# Altium project STM32G4_DRV8301_hardware.PrjPcb (part 2 of 5)

## Sheet M1_DRV8301_driver.SchDoc
size 594 x 420 mm; SheetNumber: 5; SheetTotal: 9
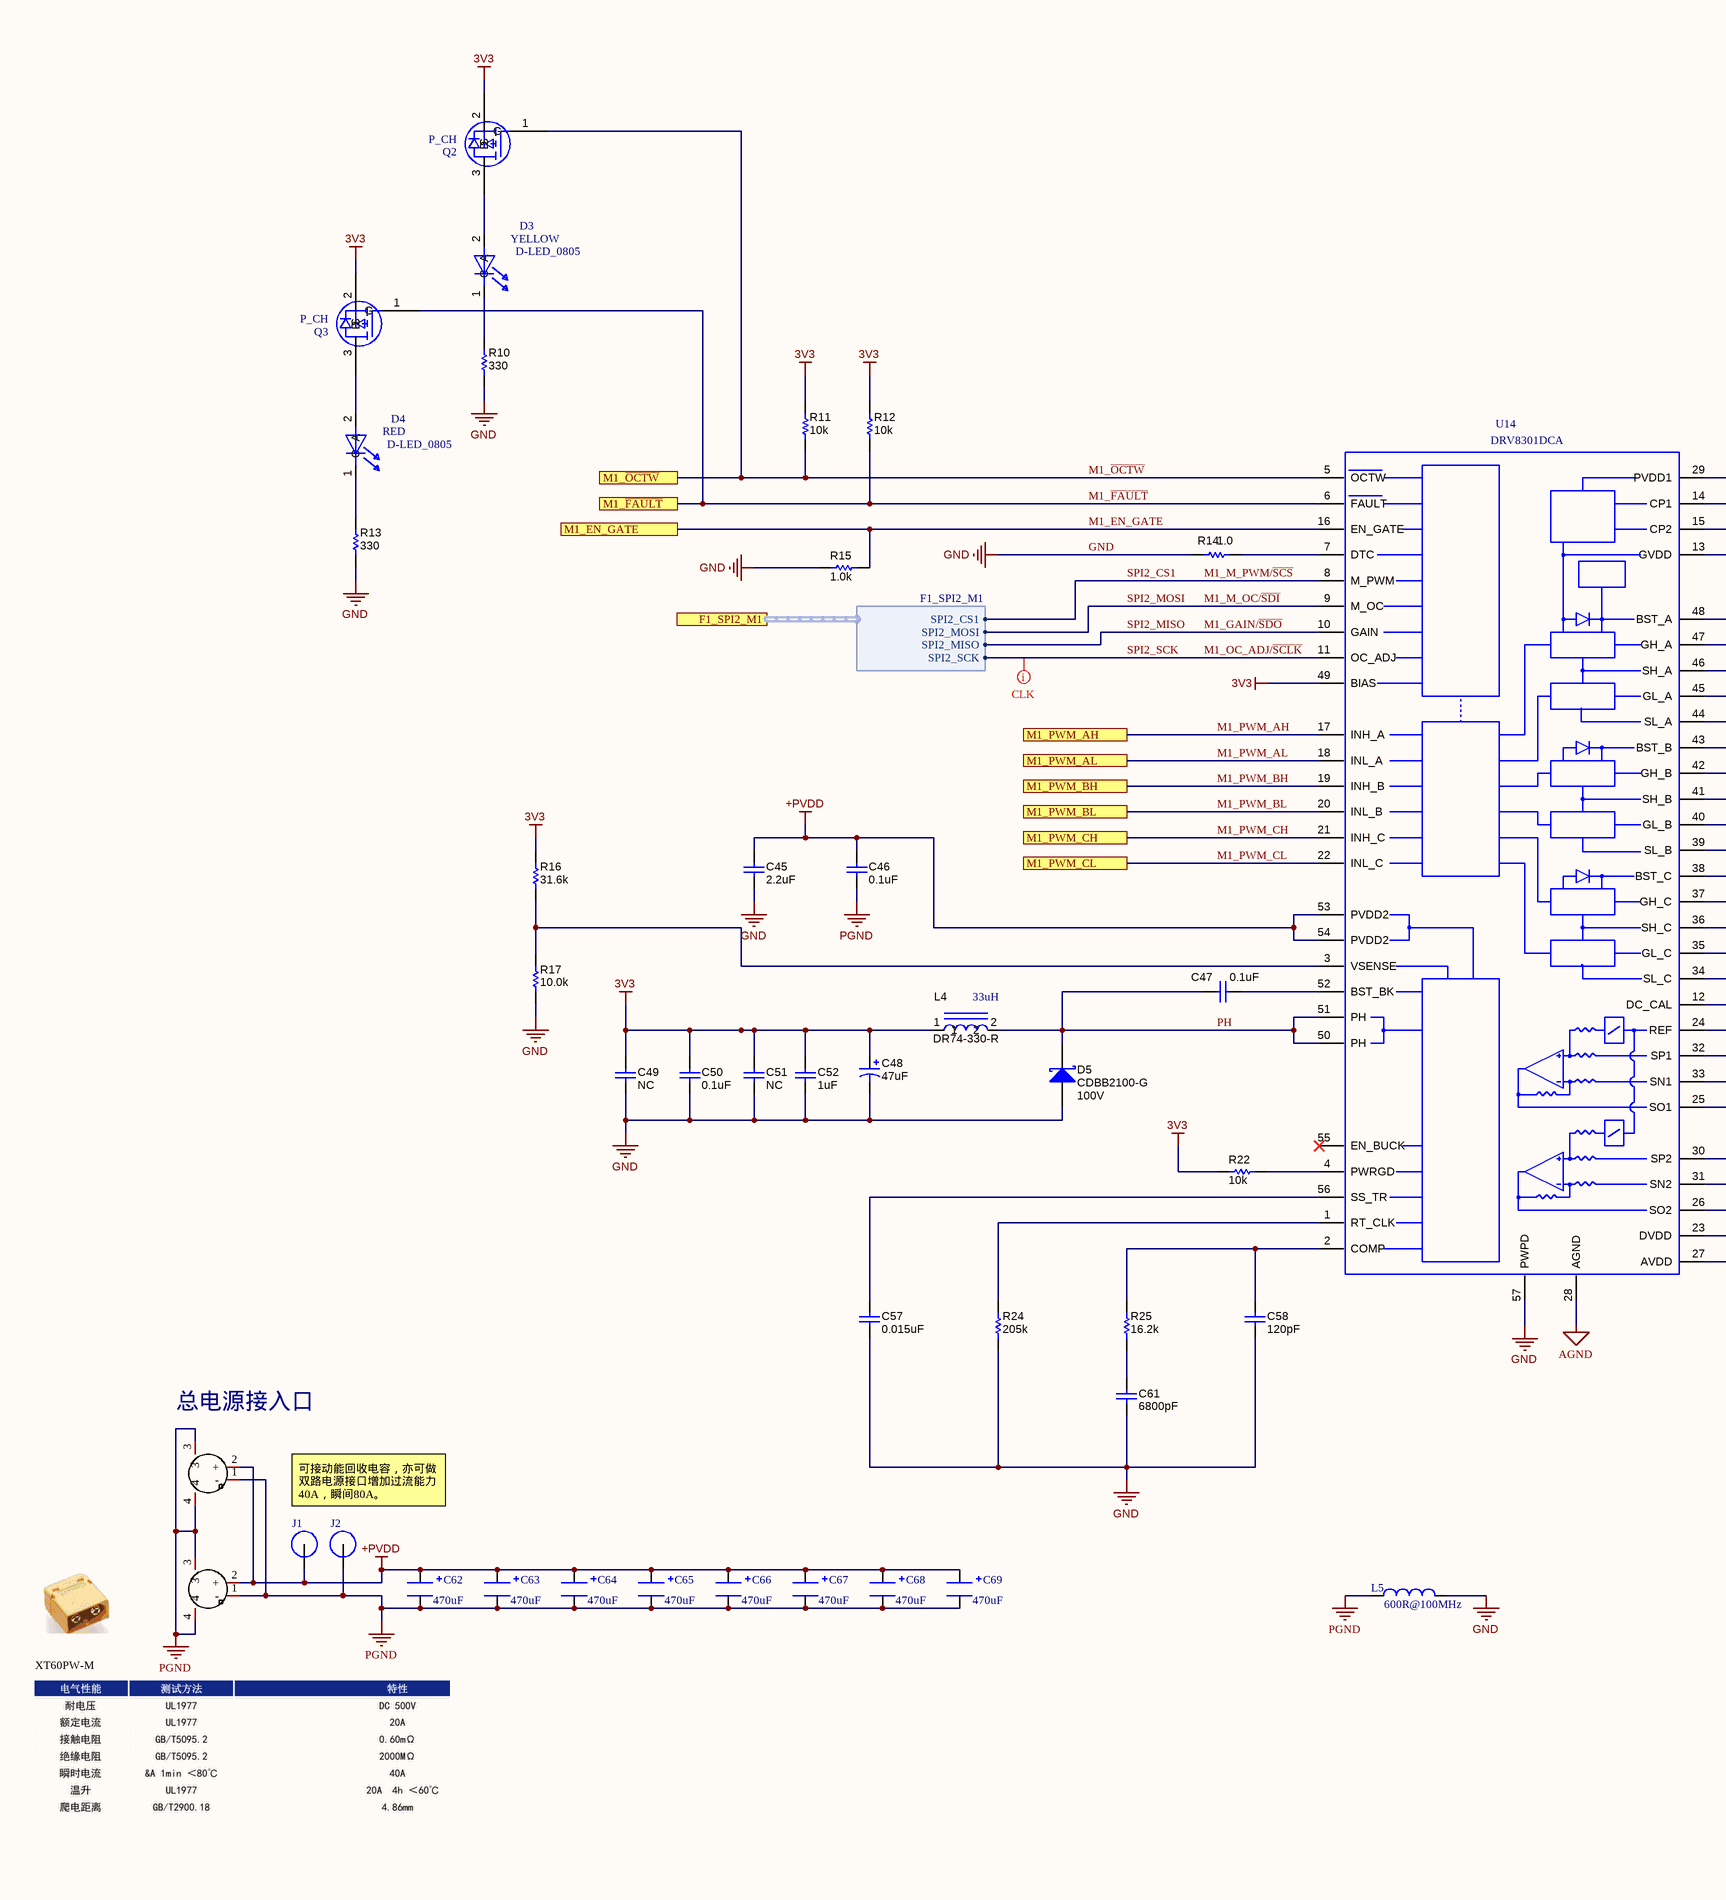
[diagram p4: M1_DRV8301_driver.SchDoc, left]
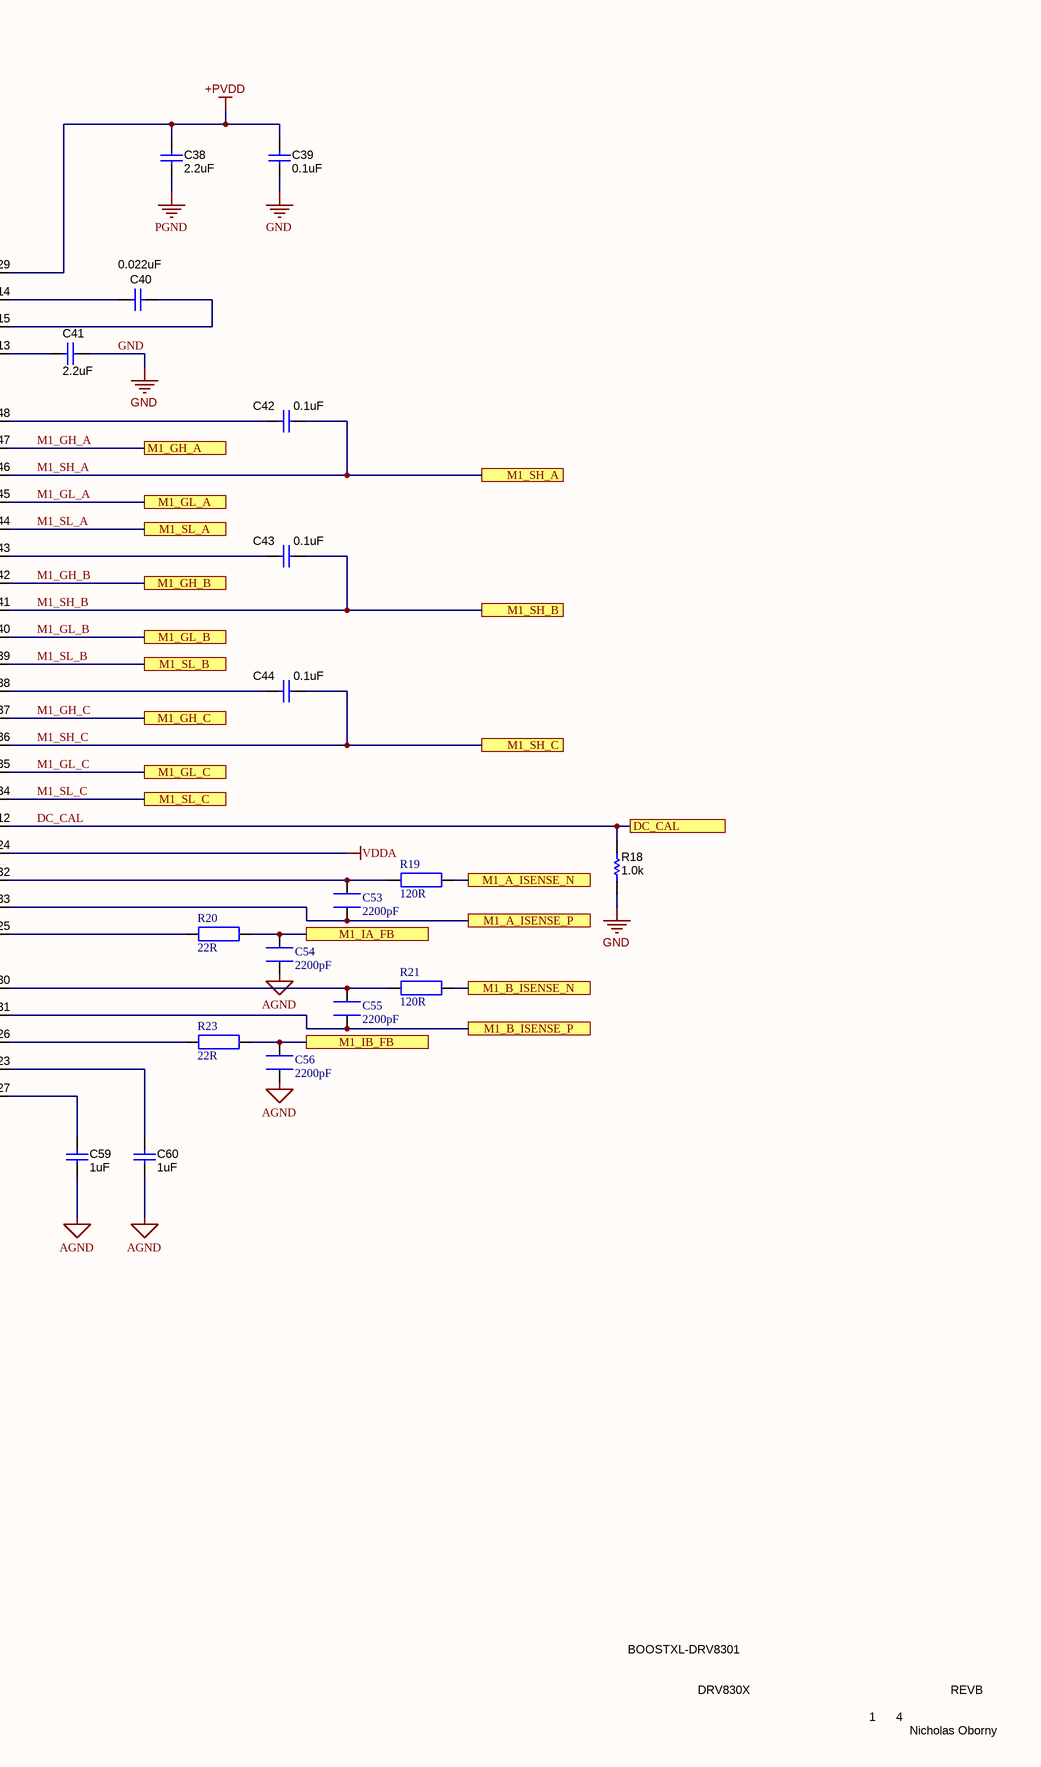
[diagram p5: M1_DRV8301_driver.SchDoc, right]

### Parts
C38  ValueDisplayed: 2.2uF  [1210L]  (hidden comment: GRM32ER72A225KA35L)
C39  ValueDisplayed: 0.1uF  [0603L]  (hidden comment: GRM188R72A104KA35D)
C40  ValueDisplayed: 0.022uF  [0603L]  (hidden comment: C1608X7R1H223K)
C41  ValueDisplayed: 2.2uF  [0805L]  (hidden comment: GRM219R61E225KA12D)
C42  ValueDisplayed: 0.1uF  [0603L]  (hidden comment: C1608X7R1H104K)
C43  ValueDisplayed: 0.1uF  [0603L]  (hidden comment: C1608X7R1H104K)
C44  ValueDisplayed: 0.1uF  [0603L]  (hidden comment: C1608X7R1H104K)
C45  ValueDisplayed: 2.2uF  [1210L]  (hidden comment: GRM32ER72A225KA35L)
C46  ValueDisplayed: 0.1uF  [0603L]  (hidden comment: GRM188R72A104KA35D)
C47  ValueDisplayed: 0.1uF  [0603L]  (hidden comment: C1608X7R1H104K)
C48  ValueDisplayed: 47uF  [SM_RADIAL_D]  (hidden comment: EEE-FK1E470P)
C49  ValueDisplayed: NC  [0603L]  (hidden comment: C1608X7R1E104K)
C50  ValueDisplayed: 0.1uF  [0603L]  (hidden comment: C1608X7R1E104K)
C51  ValueDisplayed: NC  [0603L]  (hidden comment: C1608X5R1E105K080AC)
C52  ValueDisplayed: 1uF  [0603L]  (hidden comment: C1608X5R1E105K080AC)
C53  2200pF  [CAPC1608X09L]
C54  2200pF  [CAPC1608X09L]
C55  2200pF  [CAPC1608X09L]
C56  2200pF  [CAPC1608X09L]
C57  ValueDisplayed: 0.015uF  [0603L]  (hidden comment: GRM188R71H153KA01D)
C58  ValueDisplayed: 120pF  [0603L]  (hidden comment: GRM1885C1H121JA01D)
C59  ValueDisplayed: 1uF  [0603L]  (hidden comment: GRM188R61E105KA12D)
C60  ValueDisplayed: 1uF  [0603L]  (hidden comment: GRM188R61E105KA12D)
C61  ValueDisplayed: 6800pF  [0603L]  (hidden comment: GRM188R71H682KA01D)
C62  470uF  [CAP_ELEC_SIZE_G]
C63  470uF  [CAP_ELEC_SIZE_G]
C64  470uF  [CAP_ELEC_SIZE_G]
C65  470uF  [CAP_ELEC_SIZE_G]
C66  470uF  [CAP_ELEC_SIZE_G]
C67  470uF  [CAP_ELEC_SIZE_G]
C68  470uF  [CAP_ELEC_SIZE_G]
C69  470uF  [CAP_ELEC_SIZE_G]
CN2  XT60PW-M  [CONN-TH_XT60PW-M]  (value not drawn)
CN3  XT60PW-M  [CONN-TH_XT60PW-M]  (value not drawn)
D3  D-LED_0805  value YELLOW  [LED_0805]
D4  D-LED_0805  value RED  [LED_0805]
D5  CDBB2100-G  value 100V  [SMB]
J1  (no value)  [M3 Spade Hole]
J2  (no value)  [M3 Spade Hole]
L4  DR74-330-R  value 33uH  [IND_DR74]
L5  value 600R@100MHz  [L0603]
Q2  value P_CH  [SOT-23]  (hidden comment: TR_PFET_SOT23)
Q3  value P_CH  [SOT-23]  (hidden comment: TR_PFET_SOT23)
R10  value 330  [0603L]  (hidden comment: CRCW0603330RJNEA)
R11  value 10k  [0603L]  (hidden comment: CRCW060310K0JNEA)
R12  value 10k  [0603L]  (hidden comment: CRCW060310K0JNEA)
R13  value 330  [0603L]  (hidden comment: CRCW0603330RJNEA)
R14  value 1.0  [0603L]  (hidden comment: CRCW06031R00JNEA)
R15  value 1.0k  [0603L]  (hidden comment: CRCW06031K00JNEA)
R16  value 31.6k  [0603L]  (hidden comment: CRCW060331K6FKEA)
R17  value 10.0k  [0603L]  (hidden comment: RG1608P-103-B-T5)
R18  value 1.0k  [0603L]  (hidden comment: CRCW06031K00JNEA)
R19  120R  [RESC1608X55N]
R20  22R  [RESC1608X55N]
R21  120R  [RESC1608X55N]
R22  value 10k  [0603L]  (hidden comment: CRCW060310K0JNEA)
R23  22R  [RESC1608X55N]
R24  value 205k  [0603L]  (hidden comment: CRCW0603205KFKEA)
R25  value 16.2k  [0603L]  (hidden comment: CRCW060316K2FKEA)
U14  DRV8301DCA  [DCA_56P]

### Ports
DC_CAL (see STM32G4_DRV8301_hardware_TOP_V1.0[4C], M2_DRV8301_driver[8D], STM32G4_microcontroller[3B]), F1_SPI2_M1 (harness F1_SPI2_M1, see STM32G4_DRV8301_hardware_TOP_V1.0[4D], STM32F1_microcontroller[6B]), M1_A_ISENSE_N (see STM32G4_DRV8301_hardware_TOP_V1.0[5D], DRV8301_inverter[1C]), M1_A_ISENSE_P (see STM32G4_DRV8301_hardware_TOP_V1.0[5D], DRV8301_inverter[1C]), M1_B_ISENSE_N (see STM32G4_DRV8301_hardware_TOP_V1.0[5D], DRV8301_inverter[4C]), M1_B_ISENSE_P (see STM32G4_DRV8301_hardware_TOP_V1.0[5D], DRV8301_inverter[4C]), M1_EN_GATE (see STM32G4_DRV8301_hardware_TOP_V1.0[4C]), M1_GH_A (see STM32G4_DRV8301_hardware_TOP_V1.0[5C], DRV8301_inverter[2A]), M1_GH_B (see STM32G4_DRV8301_hardware_TOP_V1.0[5C], DRV8301_inverter[4A]), M1_GH_C (see STM32G4_DRV8301_hardware_TOP_V1.0[5C], DRV8301_inverter[6A]), M1_GL_A (see STM32G4_DRV8301_hardware_TOP_V1.0[5C], DRV8301_inverter[2C]), M1_GL_B (see STM32G4_DRV8301_hardware_TOP_V1.0[5C], DRV8301_inverter[4C]), M1_GL_C (see STM32G4_DRV8301_hardware_TOP_V1.0[5D], DRV8301_inverter[6C]), M1_IA_FB (see STM32G4_DRV8301_hardware_TOP_V1.0[4C]), M1_IB_FB (see STM32G4_DRV8301_hardware_TOP_V1.0[4C]), M1_PWM_AH (see STM32G4_DRV8301_hardware_TOP_V1.0[4C]), M1_PWM_AL (see STM32G4_DRV8301_hardware_TOP_V1.0[4C]), M1_PWM_BH (see STM32G4_DRV8301_hardware_TOP_V1.0[4C]), M1_PWM_BL (see STM32G4_DRV8301_hardware_TOP_V1.0[4C]), M1_PWM_CH (see STM32G4_DRV8301_hardware_TOP_V1.0[4C]), M1_PWM_CL (see STM32G4_DRV8301_hardware_TOP_V1.0[4C]), M1_SH_A (see STM32G4_DRV8301_hardware_TOP_V1.0[5C], DRV8301_inverter[2B], DRV8301_inverter[7B]), M1_SH_B (see STM32G4_DRV8301_hardware_TOP_V1.0[5C], DRV8301_inverter[5B], DRV8301_inverter[7B]), M1_SH_C (see STM32G4_DRV8301_hardware_TOP_V1.0[5D], DRV8301_inverter[7B]), M1_SL_A (see STM32G4_DRV8301_hardware_TOP_V1.0[5C], DRV8301_inverter[2C]), M1_SL_B (see STM32G4_DRV8301_hardware_TOP_V1.0[5C], DRV8301_inverter[5C]), M1_SL_C (see STM32G4_DRV8301_hardware_TOP_V1.0[5D], DRV8301_inverter[7C]), M1_~{FAULT} (see STM32G4_DRV8301_hardware_TOP_V1.0[4D]), M1_~{OCTW} (see STM32G4_DRV8301_hardware_TOP_V1.0[4D])

### Harnesses
F1_SPI2_M1: SPI2_CS1, SPI2_SCK, SPI2_MISO, SPI2_MOSI

### Nets
3V3: C48.1(+) C49.1 C50.1 C51.1 C52.1 L4.1 Q2.2(S) Q3.2(S) R11.2 R12.2 R16.2 R22.2 U14.49(BIAS)
+PVDD: C38.1 C39.1 C45.1 C46.1 C62.1 C63.1 C64.1 C65.1 C66.1 C67.1 C68.1 C69.1 CN2.2(+) CN3.2(+) J1.1 U14.29(PVDD1) U14.53(PVDD2) U14.54(PVDD2)
AGND: C54.2 C56.2 C59.2 C60.2 U14.28(AGND)
GND: C39.2 C41.2 C45.2 C48.2(-) C49.2 C50.2 C51.2 C52.2 C57.2 C58.2 C61.2 D5.2(A) L5.2 R10.1 R13.1 R14.1 R15.1 R17.1 R18.1 R24.1 U14.57(PWPD)
PGND: C38.2 C46.2 C62.2 C63.2 C64.2 C65.2 C66.2 C67.2 C68.2 C69.2 CN2.1(-) CN2.3 CN2.4 CN3.1(-) CN3.3 CN3.4 J2.1 L5.1
VDDA: U14.24(REF)
DC_CAL: R18.2 U14.12(DC_CAL) ; port DC_CAL
M1_A_ISENSE_N: R19.1 ; port M1_A_ISENSE_N
M1_A_ISENSE_P: C53.2 U14.33(SN1) ; port M1_A_ISENSE_P
M1_B_ISENSE_N: R21.1 ; port M1_B_ISENSE_N
M1_B_ISENSE_P: C55.2 U14.31(SN2) ; port M1_B_ISENSE_P
M1_EN_GATE: R15.2 U14.16(EN_GATE) ; port M1_EN_GATE
M1_~{FAULT}: Q3.1(G) R12.1 U14.6(FAULT) ; port M1_~{FAULT}
M1_GAIN/~{SDO}: U14.10(GAIN) ; port F1_SPI2_M1.SPI2_MISO  [also labelled SPI2_MISO]
M1_GH_A: U14.47(GH_A) ; port M1_GH_A
M1_GH_B: U14.42(GH_B) ; port M1_GH_B
M1_GH_C: U14.37(GH_C) ; port M1_GH_C
M1_GL_A: U14.45(GL_A) ; port M1_GL_A
M1_GL_B: U14.40(GL_B) ; port M1_GL_B
M1_GL_C: U14.35(GL_C) ; port M1_GL_C
M1_M_OC/~{SDI}: U14.9(M_OC) ; port F1_SPI2_M1.SPI2_MOSI  [also labelled SPI2_MOSI]
M1_M_PWM/~{SCS}: U14.8(M_PWM) ; port F1_SPI2_M1.SPI2_CS1  [also labelled SPI2_CS1]
M1_~{OCTW}: Q2.1(G) R11.1 U14.5(OCTW) ; port M1_~{OCTW}
M1_OC_ADJ/~{SCLK}: U14.11(OC_ADJ) ; port F1_SPI2_M1.SPI2_SCK  [also labelled SPI2_SCK]
M1_PWM_AH: U14.17(INH_A) ; port M1_PWM_AH
M1_PWM_AL: U14.18(INL_A) ; port M1_PWM_AL
M1_PWM_BH: U14.19(INH_B) ; port M1_PWM_BH
M1_PWM_BL: U14.20(INL_B) ; port M1_PWM_BL
M1_PWM_CH: U14.21(INH_C) ; port M1_PWM_CH
M1_PWM_CL: U14.22(INL_C) ; port M1_PWM_CL
M1_SH_A: C42.2 U14.46(SH_A) ; port M1_SH_A
M1_SH_B: C43.2 U14.41(SH_B) ; port M1_SH_B
M1_SH_C: C44.2 U14.36(SH_C) ; port M1_SH_C
M1_SL_A: U14.44(SL_A) ; port M1_SL_A
M1_SL_B: U14.39(SL_B) ; port M1_SL_B
M1_SL_C: U14.34(SL_C) ; port M1_SL_C
PH: C47.1 D5.1(K) L4.2 U14.50(PH) U14.51(PH)
NetC40_1: C40.1 U14.14(CP1)
NetC40_2: C40.2 U14.15(CP2)
NetC41_1: C41.1 U14.13(GVDD)
NetC42_1: C42.1 U14.48(BST_A)
NetC43_1: C43.1 U14.43(BST_B)
NetC44_1: C44.1 U14.38(BST_C)
NetC47_2: C47.2 U14.52(BST_BK)
NetC53_1: C53.1 R19.2 U14.32(SP1)
NetC54_1: C54.1 R20.1 ; port M1_IA_FB
NetC55_1: C55.1 R21.2 U14.30(SP2)
NetC56_1: C56.1 R23.1 ; port M1_IB_FB
NetC57_1: C57.1 U14.56(SS_TR)
NetC58_1: C58.1 R25.2 U14.2(COMP)
NetC59_1: C59.1 U14.27(AVDD)
NetC60_1: C60.1 U14.23(DVDD)
NetC61_1: C61.1 R25.1
NetD3_1: D3.1(C) R10.2
NetD3_2: D3.2(A) Q2.3(D)
NetD4_1: D4.1(C) R13.2
NetD4_2: D4.2(A) Q3.3(D)
NetR14_2: R14.2 U14.7(DTC)
NetR16_1: R16.1 R17.2 U14.3(VSENSE)
NetR20_2: R20.2 U14.25(SO1)
NetR22_1: R22.1 U14.4(PWRGD)
NetR23_2: R23.2 U14.26(SO2)
NetR24_2: R24.2 U14.1(RT_CLK)

Not connected (* = marked no-connect by the designer): U14 55(EN_BUCK)*

### Layout directives
mark named CLK: M1_OC_ADJ/~{SCLK}

### Notes on the sheet
- (near CN2) 总电源接入口
- 可接动能回收电容，亦可做双路电源接口增加过流能力40A，瞬间80A。
- XT60PW-M
- BOOSTXL-DRV8301
- DRV830X
- 1
- 4
- Nicholas Oborny
- REVB
- DWG NO:
- REV:
- THIS DOCUMENT AND THE DATA DISCLOSED HEREIN OR
- HEREWITH IS THE PROPERTY OF ALTIUM LIMITED AND MAY
- BE FREELY DISTRIBUTED IN WHOLE. NO RIGHTS ARE
- RESERVED OR EXPRESS OR IMPLIED WARANTEE GIVEN.
- REVISION
- DESCRIPTION
- DATE
- APPROVED
- ENG:
- APPROVALS
- PROJECT
- DSN:
- CHK:
- REFERENCE DOCUMENTS
- PROJECT REVISION:
- TITLE
- DOCUMENT REVISION:
- DESIGN ITEM:
- BOM:
- FAB DWG:
- PCB DWG:
- ASSY DWG:
- SCALE:
- A2
- SIZE
- CAGE CODE
- FILE NAME
- DWG NO.
- SHEET
- OF
- REV

### Library data of the parts
C38 C45 = GRM32ER72A225KA35L: CAP, CERM, 2.2uF, 100V, +/-10%, X7R, 1210; Manufacturer: MuRata; Polarized: N; CompType: Capacitor; U/M: EA; Cap_F: 0.0000022; Tolerance_%: 10; ESR_Ohm: 0.007; Value1: 0.007 ohm; VDC_V: 100; IRMS_A: 4.4; TaMin_C: -55; TaMax_C: 125; Cap_Case: 1210; SymbolVersion: 2008-07-09; Value: 2.2uF; PartNumber: GRM32ER72A225KA35L; PackageReference: 1210; RoHS: Y; Value2: 100V; MountType: SMT; Technology: Ceramic; TempCo: X7R; Published: 2008-06-19; Publisher: Texas Instruments; LatestRevisionDate: 2013-05-24; LatestRevisionNote: Changed publisher; ComponentLink1Description: Datasheet link; ComponentLink1URL: http://search.murata.co.jp/Ceramy/PnsearchViewAction.do?HnOFG=ON&HnNFG=ON&SEL_CNT=50&sLang=en&sKey=GRM32ER72A225KA35L&x=9&y=9&search=startwith; Supplier 1: Digi-Key; Supplier Part Number 1: 490-3385-1-ND; Supplier 2: Mouser; Supplier Part Number 2: 81-GRM32ER72A225KA35; Supplier 3: Farnell; Supplier Part Number 3: 1735547
C39 C46 = GRM188R72A104KA35D: CAP, CERM, 0.1uF, 100V, +/-10%, X7R, 0603; Manufacturer: MuRata; Polarized: N; CompType: Capacitor; U/M: EA; Cap_F: 0.0000001; Tolerance_%: 10; Value1: Unknown; VDC_V: 100; TaMin_C: -55; TaMax_C: 125; Cap_Case: 0603; SymbolVersion: 2008-07-09; Value: 0.1uF; PartNumber: GRM188R72A104KA35D; PackageReference: 0603; RoHS: Y; Value2: 100V; MountType: SMT; Technology: Ceramic; TempCo: X7R; Published: 2008-06-19; Publisher: Texas Instruments; LatestRevisionDate: 2013-05-24; LatestRevisionNote: Changed publisher; ComponentLink1Description: Datasheet link; ComponentLink1URL: http://search.murata.co.jp/Ceramy/PnsearchViewAction.do?HnOFG=ON&HnNFG=ON&SEL_CNT=50&sLang=en&sKey=GRM188R72A104KA35D&x=9&y=9&search=startwith; Supplier 1: Digi-Key; Supplier Part Number 1: 490-3285-1-ND; Supplier 2: Mouser; Supplier Part Number 2: 81-GRM188R72A104KA35; Supplier 3: Farnell; Supplier Part Number 3: 1828921
C40 = C1608X7R1H223K: CAP, CERM, 0.022uF, 50V, +/-10%, X7R, 0603; Manufacturer: TDK; Polarized: N; CompType: Capacitor; U/M: EA; Cap_F: 0.000000022; Tolerance_%: 10; ESR_Ohm: 0.0383; Value1: 0.0383 ohm; VDC_V: 50; TaMin_C: -55; TaMax_C: 125; Cap_Case: 0603; SymbolVersion: 2008-07-09; Value: 0.022uF; PartNumber: C1608X7R1H223K; PackageReference: 0603; RoHS: Y; Value2: 50V; MountType: SMT; Technology: Ceramic; TempCo: X7R; Published: 2008-06-19; Publisher: Texas Instruments; LatestRevisionDate: 2013-05-24; LatestRevisionNote: Changed publisher; ComponentLink1Description: Datasheet link; ComponentLink1URL: http://www.tdk.co.jp/tefe02/e412_c.pdf; Supplier 1: Digi-Key; Supplier Part Number 1: 445-1312-1-ND; Supplier 2: Farnell; Supplier Part Number 2: 1907316
C41 = GRM219R61E225KA12D: CAP, CERM, 2.2uF, 25V, +/-10%, X5R, 0805; Manufacturer: MuRata; Polarized: N; CompType: Capacitor; U/M: EA; Cap_F: 0.0000022; Tolerance_%: 10; ESR_Ohm: 0.006; Value1: 0.006 ohm; VDC_V: 25; TaMin_C: -55; TaMax_C: 85; Cap_Case: 0805; SymbolVersion: 2008-07-09; Value: 2.2uF; PartNumber: GRM219R61E225KA12D; PackageReference: 0805; RoHS: Y; Value2: 25V; MountType: SMT; Technology: Ceramic; TempCo: X5R; Published: 2008-06-19; Publisher: Texas Instruments; LatestRevisionDate: 2013-05-24; LatestRevisionNote: Changed publisher; ComponentLink1Description: Datasheet link; ComponentLink1URL: http://search.murata.co.jp/Ceramy/PnsearchViewAction.do?HnOFG=ON&HnNFG=ON&SEL_CNT=50&sLang=en&sKey=GRM219R61E225KA12D&x=9&y=9&search=startwith; Supplier 1: Digi-Key; Supplier Part Number 1: 490-1701-1-ND; Supplier 2: Mouser; Supplier Part Number 2: 81-GRM219R61E225K; Supplier 3: Farnell; Supplier Part Number 3: 1845749
C42-C44 C47 = C1608X7R1H104K: CAP, CERM, 0.1uF, 50V, +/-10%, X7R, 0603; Manufacturer: TDK; Polarized: N; CompType: Capacitor; U/M: EA; Cap_F: 0.0000001; Tolerance_%: 10; ESR_Ohm: 0.017; Value1: 0.017 ohm; VDC_V: 50; TaMin_C: -55; TaMax_C: 125; Cap_Case: 0603; SymbolVersion: 2008-07-09; Value: 0.1uF; PartNumber: C1608X7R1H104K; PackageReference: 0603; RoHS: Y; Value2: 50V; MountType: SMT; Technology: Ceramic; TempCo: X7R; Published: 2008-06-19; Publisher: Texas Instruments; LatestRevisionDate: 2013-05-24; LatestRevisionNote: Changed publisher; ComponentLink1Description: Datasheet link; ComponentLink1URL: http://www.tdk.co.jp/tefe02/e412_c.pdf; Supplier 1: Digi-Key; Supplier Part Number 1: 445-1314-1-ND; Supplier 2: Farnell; Supplier Part Number 2: 1118182
C48 = EEE-FK1E470P: CAP, AL, 47uF, 25V, +/-20%, 0.36 ohm, SMD; Manufacturer: Panasonic; Polarized: Y; CompType: Capacitor; U/M: EA; Cap_F: 0.000047; Tolerance_%: 20; VDC_V: 25; ESR_Ohm: 0.36; IRMS_A: 0.24; TaMin_C: -55; TaMax_C: 105; Cap_Case: D; SymbolVersion: 2008-07-09; Value: 47uF; PartNumber: EEE-FK1E470P; PackageReference: SMT Radial D; RoHS: Y; Value1: 0.36 ohm; Value2: 25V; MountType: SMT; Technology: AL; Series: FK; Publisher: Texas Instruments; LatestRevisionDate: 2013-05-31; ComponentLink1Description: Datasheet link; ComponentLink1URL: http://www.panasonic.com/industrial/components/pdf/smt_aec_050505.pdf; Supplier 1: Digi-Key; Supplier Part Number 1: PCE3804CT-ND; Supplier 2: Mouser; Supplier Part Number 2: 667-EEE-FK1E470P; Supplier 3: Farnell; Supplier Part Number 3: 9695753
C49 C50 = C1608X7R1E104K: CAP, CERM, 0.1uF, 25V, +/-10%, X7R, 0603; Manufacturer: TDK; Polarized: N; CompType: Capacitor; U/M: EA; Cap_F: 0.0000001; Tolerance_%: 10; ESR_Ohm: 0.017; Value1: 0.017 ohm; VDC_V: 25; TaMin_C: -55; TaMax_C: 125; Cap_Case: 0603; SymbolVersion: 2008-07-09; Value: 0.1uF; PartNumber: C1608X7R1E104K; PackageReference: 0603; RoHS: Y; Value2: 25V; MountType: SMT; Technology: Ceramic; TempCo: X7R; Published: 2008-06-19; Publisher: Texas Instruments; LatestRevisionDate: 2013-05-24; LatestRevisionNote: Changed publisher; ComponentLink1Description: Datasheet link; ComponentLink1URL: http://www.tdk.co.jp/tefe02/e412_c.pdf; Supplier 1: Digi-Key; Supplier Part Number 1: 445-1316-1-ND; Supplier 2: Farnell; Supplier Part Number 2: 1844230
C51 C52 = C1608X5R1E105K080AC: CAP, CERM, 1uF, 25V, +/-10%, X5R, 0603; Manufacturer: TDK; Polarized: N; CompType: Capacitor; U/M: EA; Cap_F: 0.000001; Tolerance_%: 10; Value1: Unknown; VDC_V: 25; TaMin_C: -55; TaMax_C: 85; Cap_Case: 0603; SymbolVersion: 2008-07-09; Value: 1uF; PartNumber: C1608X5R1E105K080AC; PackageReference: 0603; RoHS: Y; Value2: 25V; MountType: SMT; Technology: Ceramic; TempCo: X5R; Published: 2008-06-19; Publisher: Texas Instruments; LatestRevisionDate: 2013-05-24; LatestRevisionNote: Changed publisher; ComponentLink1Description: Datasheet link; ComponentLink1URL: http://product.tdk.com/capacitor/mlcc/en/documents/mlcc_commercial_general_en.pdf; Supplier 1: Digi-Key; Supplier Part Number 1: 445-5146-1-ND; Supplier 2: Newark; Supplier Part Number 2: 90R7677
C53-C56 = GRM1885C1H222JA01D: CAP CER 2200PF 50V NP0 0603; Manufacturer: Murata Electronics North America; Tolerance: ±5%; Temperature Coefficient: C0G, NP0; Supplier 1: Digi-Key; Supplier Part Number 1: 490-1459-1-ND; RoHS: RoHS Compliant; Category: Capacitors; Stock 1: 850589; Pricing 1: 1=0.11, 10=0.08, 25=0.058, 50=0.0434, 100=0.0355, 250=0.02972, 500=0.02536, 1000=0.01992 (USD); Packaging: Cut Tape (CT); Capacitance: 2200pF; Voltage - Rated: 50V; Mounting Type: Surface Mount, MLCC; Operating Temperature: -55°C ~ 125°C; Applications: General Purpose; Ratings: -; Package / Case: 0603 (1608 Metric); Size / Dimension: 0.063" L x 0.031" W (1.60mm x 0.80mm); Height - Seated (Max): -; Thickness (Max): 0.035" (0.90mm); Lead Spacing: -; Features: -; Lead Style: -; ComponentLink1URL: http://www.murata.com/~/media/webrenewal/support/library/catalog/products/capacitor/mlcc/c02e.ashx; ComponentLink1Description: http://www.murata.com/~/media/webrenewal/support/library/catalog/products/capacitor/mlcc/c02e.ashx; Part Status: Active
C57 = GRM188R71H153KA01D: CAP, CERM, 0.015uF, 50V, +/-10%, X7R, 0603; Manufacturer: MuRata; Polarized: N; CompType: Capacitor; U/M: EA; Cap_F: 0.000000015; Tolerance_%: 10; Value1: Unknown; VDC_V: 50; TaMin_C: -55; TaMax_C: 125; Cap_Case: 0603; SymbolVersion: 2008-07-09; Value: 0.015uF; PartNumber: GRM188R71H153KA01D; PackageReference: 0603; RoHS: Y; Value2: 50V; MountType: SMT; Technology: Ceramic; TempCo: X7R; Published: 2008-06-19; Publisher: Texas Instruments; LatestRevisionDate: 2013-05-24; LatestRevisionNote: Changed publisher; ComponentLink1Description: Datasheet link; ComponentLink1URL: http://search.murata.co.jp/Ceramy/PnsearchViewAction.do?HnOFG=ON&HnNFG=ON&SEL_CNT=50&sLang=en&sKey=GRM188R71H153KA01D&x=9&y=9&search=startwith; Supplier 1: Digi-Key; Supplier Part Number 1: 490-1514-1-ND; Supplier 2: Mouser; Supplier Part Number 2: 81-GRM18R71H153KA01D; Supplier 3: Farnell; Supplier Part Number 3: 1828916
C58 = GRM1885C1H121JA01D: CAP, CERM, 120pF, 50V, +/-5%, C0G/NP0, 0603; Manufacturer: MuRata; Polarized: N; CompType: Capacitor; U/M: EA; Cap_F: 0.00000000012; Tolerance_%: 5; Value1: Unknown; VDC_V: 50; TaMin_C: -55; TaMax_C: 125; Cap_Case: 0603; SymbolVersion: 2008-07-09; Value: 120pF; PartNumber: GRM1885C1H121JA01D; PackageReference: 0603; RoHS: Y; Value2: 50V; MountType: SMT; Technology: Ceramic; TempCo: C0G/NP0; Published: 2008-06-19; Publisher: Texas Instruments; LatestRevisionDate: 2013-05-24; LatestRevisionNote: Changed publisher; ComponentLink1Description: Datasheet link; ComponentLink1URL: http://search.murata.co.jp/Ceramy/PnsearchViewAction.do?HnOFG=ON&HnNFG=ON&SEL_CNT=50&sLang=en&sKey=GRM1885C1H121JA01D&x=9&y=9&search=startwith; Supplier 1: Digi-Key; Supplier Part Number 1: 490-1429-1-ND; Supplier 2: Mouser; Supplier Part Number 2: 81-GRM39C121J50; Supplier 3: Farnell; Supplier Part Number 3: 1403555
C59 C60 = GRM188R61E105KA12D: CAP, CERM, 1uF, 25V, +/-10%, X5R, 0603; Manufacturer: MuRata; Polarized: N; CompType: Capacitor; U/M: EA; Cap_F: 0.000001; Tolerance_%: 10; Value1: Unknown; VDC_V: 25; TaMin_C: -55; TaMax_C: 85; Cap_Case: 0603; SymbolVersion: 2008-07-09; Value: 1uF; PartNumber: GRM188R61E105KA12D; PackageReference: 0603; RoHS: Y; Value2: 25V; MountType: SMT; Technology: Ceramic; TempCo: X5R; Published: 2008-06-19; Publisher: Texas Instruments; LatestRevisionDate: 2013-05-24; LatestRevisionNote: Changed publisher; ComponentLink1Description: Datasheet link; ComponentLink1URL: http://search.murata.co.jp/Ceramy/PnsearchViewAction.do?HnOFG=ON&HnNFG=ON&SEL_CNT=50&sLang=en&sKey=GRM188R61E105KA12D&x=9&y=9&search=startwith; Supplier 1: Digi-Key; Supplier Part Number 1: 490-3897-1-ND; Supplier 2: Mouser; Supplier Part Number 2: 81-GRM188R61E105KA12; Supplier 3: Farnell; Supplier Part Number 3: 1828802
C61 = GRM188R71H682KA01D: CAP, CERM, 6800pF, 50V, +/-10%, X7R, 0603; Manufacturer: MuRata; Polarized: N; CompType: Capacitor; U/M: EA; Cap_F: 0.0000000068; Tolerance_%: 10; Value1: Unknown; VDC_V: 50; TaMin_C: -55; TaMax_C: 125; Cap_Case: 0603; SymbolVersion: 2008-07-09; Value: 6800pF; PartNumber: GRM188R71H682KA01D; PackageReference: 0603; RoHS: Y; Value2: 50V; MountType: SMT; Technology: Ceramic; TempCo: X7R; Published: 2008-06-19; Publisher: Texas Instruments; LatestRevisionDate: 2013-05-24; LatestRevisionNote: Changed publisher; ComponentLink1Description: Datasheet link; ComponentLink1URL: http://search.murata.co.jp/Ceramy/PnsearchViewAction.do?HnOFG=ON&HnNFG=ON&SEL_CNT=50&sLang=en&sKey=GRM188R71H682KA01D&x=9&y=9&search=startwith; Supplier 1: Digi-Key; Supplier Part Number 1: 490-1508-1-ND; Supplier 2: Mouser; Supplier Part Number 2: 81-GRM39X682K50D; Supplier 3: Farnell; Supplier Part Number 3: 1403792
C62-C69 = EEEFP1E471AP: CAP, FP Series, 470 µF, 25 V, Radial Can - SMD, 10 mm; Manufacturer: Panasonic Electronic Components; Manufacturer Part Number: EEE-FP1E471AP; Tolerance: ±20%; ESR (Equivalent Series Resistance): 60 mOhm @ 100kHz; Lifetime @ Temp.: 2000 Hrs @ 105°C; Polarization: Polar; Ripple Current - Low Frequency: 773.5mA @ 120Hz; Ripple Current - High Frequency: 1.19A @ 100kHz; Surface Mount Land Size: 0.406" L x 0.406" W (10.30mm x 10.30mm); Value: 470uF; Supplier 1: Digi-Key; Supplier Part Number 1: PCE4440TR-ND; RoHS: RoHS Compliant; Category: Capacitors; Stock: 8000; Pricing 1: 500=0.3571, 1000=0.30072, 2500=0.28192, 5000=0.26313, 12500=0.24997, 25000=0.24434 (USD); Packaging: Tape & Reel (TR); Part Status: Active; Operating Temperature: -55°C ~ 105°C; Applications: Automotive; Lead Spacing: -; Size / Dimension: 0.394" Dia (10.00mm); Height - Seated (Max): 0.402" (10.20mm); Mounting Type: Surface Mount; Package / Case: Radial, Can - SMD; ComponentLink1URL: http://industrial.panasonic.com/www-cgi/jvcr13pz.cgi?E+PZ+3+ABA0114+EEEFP1E471AP+7+WW; ComponentLink1Description: http://industrial.panasonic.com/www-cgi/jvcr13pz.cgi?E+PZ+3+ABA0114+EEEFP1E471AP+7+WW; Supplier 2: Digi-Key; Supplier Part Number 2: PCE4440CT-ND; Pricing 2: 1=0.92, 10=0.702, 100=0.5025 (USD)
CN2 CN3 = XT60PW-M: Manufacturer: AMASS(艾迈斯); Add into BOM: yes; Brand: 艾迈斯; InterfaceType: 公头; Symbol: XT60PW-M; Device: XT60PW-M; LCSC Part Name: AMASS(艾迈斯)航模插头xt60连接器150公母对接pw锂电池公头 板插卧式XT60PW-M; Supplier Part: C98732; Manufacturer Part: XT60PW-M; Supplier Footprint: -; JLCPCB Part Class: Extended Part; Datasheet: https://atta.szlcsc.com/upload/public/pdf/source/20240118/44A3DCFF53BE25DC65378AFFB21277A4.pdf; Supplier: LCSC; Convert to PCB: yes; Model: XT60PW-M; Power: -; Output: -; Input: -; Size: -; Interface: -; Type: 卧式插头; Colour: 黄色; MaximumCurrent: -; RatedVoltage: -; Type1: -; NumberOfUSBHoles: -; MetalMaterial: -; InsulationMaterial: -; RatedCurrent: -; RecommendedWireGauge: -; FlameRetardantGrade: -; contact resistance: -; Belt length: -; specifications: -
D3 = D-LED_0805: LED THIN 585NM YEL DIFF 0805 SMD; PartNumber: SML-LXT0805YW-TR; Manufacturer: Lumex Opto/Components Inc; Vendor Part #: 67-1554-1-ND; PCB DECAL: LED-0805DA; Vendor: DigiKey; ModifyDate: 10/26/2011 10:26:35; ComponentHeight: 0.80 mm; Size: 805
D4 = D-LED_0805: LED THIN660NM SUPRED DIFF0805SMD; PartNumber: SML-LXT0805SRW-TR; Manufacturer: Lumex Opto/Components Inc; Vendor Part #: 67-1555-1-ND; Vendor: DigiKey; ModifyDate: 10/26/2011 10:26:35; PCB DECAL: LED-0805; ComponentHeight: 0.80 mm; Size: 805
D5 = CDBC5100-G: Diode, Schottky, 100V, 2A, SMB; Manufacturer: Comchip Technology; U/M: EA; Vf_V: 0.85; Value2: 0.85V; Io_A: 2; Vr_V: 100; TJmax_C: 125; CompType: Diode; SymbolVersion: 2008-12-08; PartNumber: CDBB2100-G; PackageReference: SMB; Value1: 2A; MountType: SMT; Type: Schottky; RoHS: Y; Published: 2008-06-26; Publisher: Texas Instruments; LatestRevisionDate: 2013-06-04; ComponentLink1Description: Datasheet link; ComponentLink1URL: http://www.comchiptech.com/cms/UserFiles/CDBB220-G%20Thru935254.%20CDBB2100-G%20RevB.pdf; Supplier 1: Digi-Key; Supplier Part Number 1: 641-1109-1-ND; Supplier 2: Mouser; Supplier Part Number 2: 750-CDBB2100-G
J1 J2 = M3 Spade Terminal
L4 = IND_DR74-XXX: INDUCTOR SHIELD PWR 33UH SMD; Manufacturer: Cooper Bussmann; Area: 122500; ComponentLink1URL: \\vette02\pmp_pcb\pcad_pdf's\DR series inductor.pdf; ComponentHeight: 0.175; PackageReference: 0.300" sq; SymbolVersion: 07/31/2009 12:17:29; PartNumber: DR74-330-R; ComponentLink1Description: AEO Datasheet Link
L5 = MCD-00047: as L1 on sheet STM32G4_microcontroller_Power; Internal_Part_Number: MCD-00047; Status: Released; ComponentLink1Description: Datasheet; ComponentLink1URL: http://tunmcdsvn.tun.st.com/Component_Datasheet_Library/Trunk/Inductors/TaiTech_Bead_FCM1608_series; ECCN_US: n/a; ECCN_EU: n/a
Q2 Q3 = TR_PFET_SOT23: MOSFET P-CH 8V 5.4A SOT23-3; PartNumber: SI2325DS-T1-E3; Manufacturer: Vishey Siliconix; Vendor Part #: S12325DS-T1-E3CT-ND; Vendor: DigiKey; ModifyDate: 11/01/2006 14:12:04; ComponentHeight: 0.043 inch; PCB DECAL: SOT-23; Size: SOT-23
R10 R13 = CRCW0603330RJNEA: RES, 330 ohm, 5%, 0.1W, 0603; Manufacturer: Vishay-Dale; CompType: Resistor; Value_Code: 330R; Tolerance_%: 5; Power_W: 0.1; VDC_V: 75; TempCo: 200 ppm/C; EIA_Code: E24; U/M: EA; SymbolVersion: 2009-05-29; PartNumber: CRCW0603330RJNEA; PackageReference: 0603; RoHS: Y; Res_ohm: 330; Value1: 5%; Value2: 0.1W; MountType: SMT; Technology: Thick Film; Published: 2008-06-26; Publisher: Texas Instruments; LatestRevisionDate: 2013-01-08; ComponentLink1Description: Datasheet link; ComponentLink1URL: http://www.vishay.com/docs/20035/dcrcwe3.pdf; Supplier 1: Digi-Key; Supplier Part Number 1: 541-330GCT-ND; Supplier 2: Mouser; Supplier Part Number 2: 71-CRCW0603J-330-E3; Supplier 3: Farnell; Supplier Part Number 3: 1692522
R11 R12 R22 = CRCW060310K0JNEA: RES, 10k ohm, 5%, 0.1W, 0603; Manufacturer: Vishay-Dale; CompType: Resistor; Res_ohm: 10000; Value_Code: 10k0; Tolerance_%: 5; Power_W: 0.1; VDC_V: 75; TempCo: 200 ppm/C; EIA_Code: E24; U/M: EA; SymbolVersion: 2009-05-29; PartNumber: CRCW060310K0JNEA; PackageReference: 0603; RoHS: Y; Value1: 5%; Value2: 0.1W; MountType: SMT; Technology: Thick Film; Published: 2008-06-26; Publisher: Texas Instruments; LatestRevisionDate: 2013-01-08; ComponentLink1Description: Datasheet link; ComponentLink1URL: http://www.vishay.com/docs/20035/dcrcwe3.pdf; Supplier 1: Digi-Key; Supplier Part Number 1: 541-10KGCT-ND; Supplier 2: Farnell; Supplier Part Number 2: 1562240; Supplier 3: Newark; Supplier Part Number 3: 52K8066
R14 = CRCW06031R00JNEA: RES, 1.0 ohm, 5%, 0.1W, 0603; Manufacturer: Vishay-Dale; CompType: Resistor; Res_ohm: 1; Value_Code: 1R00; Tolerance_%: 5; Power_W: 0.1; VDC_V: 75; TempCo: 200 ppm/C; EIA_Code: E24; U/M: EA; SymbolVersion: 2009-05-29; PartNumber: CRCW06031R00JNEA; PackageReference: 0603; RoHS: Y; Value1: 5%; Value2: 0.1W; MountType: SMT; Technology: Thick Film; Published: 2008-06-26; Publisher: Texas Instruments; LatestRevisionDate: 2013-01-08; ComponentLink1Description: Datasheet link; ComponentLink1URL: http://www.vishay.com/docs/20035/dcrcwe3.pdf; Supplier 1: Digi-Key; Supplier Part Number 1: 541-1.0GCT-ND; Supplier 2: Mouser; Supplier Part Number 2: 71-CRCW0603J-1-E3; Supplier 3: Farnell; Supplier Part Number 3: 1514709
R15 R18 = CRCW06031K00JNEA: RES, 1.0k ohm, 5%, 0.1W, 0603; Manufacturer: Vishay-Dale; CompType: Resistor; Res_ohm: 1000; Value_Code: 1k00; Tolerance_%: 5; Power_W: 0.1; VDC_V: 75; TempCo: 200 ppm/C; EIA_Code: E24; U/M: EA; SymbolVersion: 2009-05-29; PartNumber: CRCW06031K00JNEA; PackageReference: 0603; RoHS: Y; Value1: 5%; Value2: 0.1W; MountType: SMT; Technology: Thick Film; Published: 2008-06-26; Publisher: Texas Instruments; LatestRevisionDate: 2013-01-08; ComponentLink1Description: Datasheet link; ComponentLink1URL: http://www.vishay.com/docs/20035/dcrcwe3.pdf; Supplier 1: Digi-Key; Supplier Part Number 1: 541-1.0KGCT-ND; Supplier 2: Farnell; Supplier Part Number 2: 1652851; Supplier 3: Newark; Supplier Part Number 3: 59M6750
R16 = CRCW060331K6FKEA: RES, 31.6k ohm, 1%, 0.1W, 0603; Manufacturer: Vishay-Dale; CompType: Resistor; Res_ohm: 31600; Value_Code: 31k6; Tolerance_%: 1; Power_W: 0.1; VDC_V: 75; TempCo: 100 ppm/C; EIA_Code: E96; U/M: EA; SymbolVersion: 2009-05-29; PartNumber: CRCW060331K6FKEA; PackageReference: 0603; RoHS: Y; Value1: 1%; Value2: 0.1W; MountType: SMT; Technology: Thick Film; Published: 2008-06-26; Publisher: Texas Instruments; LatestRevisionDate: 2013-01-08; ComponentLink1Description: Datasheet link; ComponentLink1URL: http://www.vishay.com/docs/20035/dcrcwe3.pdf; Supplier 1: Digi-Key; Supplier Part Number 1: 541-31.6KHCT-ND; Supplier 2: Mouser; Supplier Part Number 2: 71-CRCW0603-31.6K-E3; Supplier 3: Farnell; Supplier Part Number 3: 1151933
R17 = RG1608P-103-B-T5: RES, 10.0k ohm, 0.1%, 0.1W, 0603; Manufacturer: Susumu Co Ltd; CompType: Resistor; Res_ohm: 10000; Value_Code: 10k0; Tolerance_%: 0.1; VDC_V: 75; TempCo: 25 ppm/C; EIA_Code: E192; U/M: EA; SymbolVersion: 2009-05-29; PartNumber: RG1608P-103-B-T5; PackageReference: 0603; RoHS: Y; Value1: 0.1%; Power_W: 0.1; Value2: 0.1W; MountType: SMT; Technology: Metal Film; Published: 2008-06-26; Publisher: Texas Instruments; LatestRevisionDate: 2013-01-08; ComponentLink1Description: Datasheet link; ComponentLink1URL: http://www.susumu.co.jp/english/pdf/products-j01-01.pdf; Supplier 1: Digi-Key; Supplier Part Number 1: RG16P10.0KBCT-ND; Supplier 2: Mouser; Supplier Part Number 2: 754-RG1608P-103-B-T5; Supplier 3: Farnell; Supplier Part Number 3: 1797079
R19 R21 = RC0603FR-07120RL: RES SMD 120 OHM 1% 1/10W 0603; Manufacturer: Yageo; Resistance (Ohms): 120; Power (Watts): 0.1W, 1/10W; Temperature Coefficient: ±100ppm/°C; Supplier 1: Digi-Key; Supplier Part Number 1: 311-120HRCT-ND; Manufacturer Part Number: RC0603FR-07120RL; RoHS: RoHS Compliant; Category: Resistors; Stock 1: 1545282; Pricing 1: 1=0.1, 10=0.014, 25=0.01, 100=0.0057, 250=0.00436, 500=0.00348, 1000=0.00257, 2500=0.00223 (USD); Packaging: Cut Tape (CT); Tolerance: ±1%; Composition: Thick Film; Features: Moisture Resistant; Operating Temperature: -55°C ~ 155°C; Package / Case: 0603 (1608 Metric); Supplier Device Package: 0603; Size / Dimension: 0.063" L x 0.031" W (1.60mm x 0.80mm); Height: 0.022" (0.55mm); Number of Terminations: 2; ComponentLink1URL: http://www.yageo.com/documents/recent/PYu-RC_Group_51_RoHS_L_04.pdf; ComponentLink1Description: http://www.yageo.com/documents/recent/PYu-RC_Group_51_RoHS_L_04.pdf
R20 R23 = RC0603FR-0722RL: RES SMD 22 OHM 1% 1/10W 0603; Manufacturer: Yageo; Resistance (Ohms): 22; Power (Watts): 0.1W, 1/10W; Temperature Coefficient: ±100ppm/°C; Supplier 1: Digi-Key; Supplier Part Number 1: 311-22.0HRCT-ND; Manufacturer Part Number: RC0603FR-0722RL; RoHS: RoHS Compliant; Category: Resistors; Stock 1: 575303; Pricing 1: 1=0.1, 10=0.014, 25=0.01, 100=0.0057, 250=0.00436, 500=0.00348, 1000=0.00257, 2500=0.00223 (USD); Packaging: Cut Tape (CT); Tolerance: ±1%; Composition: Thick Film; Features: Moisture Resistant; Operating Temperature: -55°C ~ 155°C; Package / Case: 0603 (1608 Metric); Supplier Device Package: 0603; Size / Dimension: 0.063" L x 0.031" W (1.60mm x 0.80mm); Height: 0.022" (0.55mm); Number of Terminations: 2; ComponentLink1URL: http://www.yageo.com/documents/recent/PYu-RC_Group_51_RoHS_L_04.pdf; ComponentLink1Description: http://www.yageo.com/documents/recent/PYu-RC_Group_51_RoHS_L_04.pdf
R24 = CRCW0603205KFKEA: RES, 205k ohm, 1%, 0.1W, 0603; Manufacturer: Vishay-Dale; CompType: Resistor; Res_ohm: 205000; Tolerance_%: 1; Power_W: 0.1; VDC_V: 75; TempCo: 100 ppm/C; EIA_Code: E96; U/M: EA; SymbolVersion: 2009-05-29; PartNumber: CRCW0603205KFKEA; PackageReference: 0603; RoHS: Y; Value_Code: 205k; Value1: 1%; Value2: 0.1W; MountType: SMT; Technology: Thick Film; Published: 2008-06-26; Publisher: Texas Instruments; LatestRevisionDate: 2013-01-08; ComponentLink1Description: Datasheet link; ComponentLink1URL: http://www.vishay.com/docs/20035/dcrcwe3.pdf; Supplier 1: Digi-Key; Supplier Part Number 1: 541-205KHCT-ND; Supplier 2: Mouser; Supplier Part Number 2: 71-CRCW0603-205K-E3; Supplier 3: Farnell; Supplier Part Number 3: 1151818
R25 = CRCW060316K2FKEA: RES, 16.2k ohm, 1%, 0.1W, 0603; Manufacturer: Vishay-Dale; CompType: Resistor; Res_ohm: 16200; Value_Code: 16k2; Tolerance_%: 1; Power_W: 0.1; VDC_V: 75; TempCo: 100 ppm/C; EIA_Code: E96; U/M: EA; SymbolVersion: 2009-05-29; PartNumber: CRCW060316K2FKEA; PackageReference: 0603; RoHS: Y; Value1: 1%; Value2: 0.1W; MountType: SMT; Technology: Thick Film; Published: 2008-06-26; Publisher: Texas Instruments; LatestRevisionDate: 2013-01-08; ComponentLink1Description: Datasheet link; ComponentLink1URL: http://www.vishay.com/docs/20035/dcrcwe3.pdf; Supplier 1: Digi-Key; Supplier Part Number 1: 541-16.2KHCT-ND; Supplier 2: Mouser; Supplier Part Number 2: 71-CRCW0603-16.2K-E3; Supplier 3: Farnell; Supplier Part Number 3: 1151719
U14 = DRV8302DCA_ERIC: IC, 3 Phase Pre-Driver with Dual Current Shunt Amplifiers and Buck Regulator-Hardware Controlled; Manufacturer: Texas Instruments; Area: 154.44 mm; Vendor: Supplied; Value: DRV8301DCA; ModifyDate: 05/02/2012 07:50:13; PartNumber: DRV8301DCA; Size: HTSSOP; PCB DECAL: DCA_56P; Vendor Part #: Supplied